# EAGLE schematic RingLight (EAGLE 9.6.2)
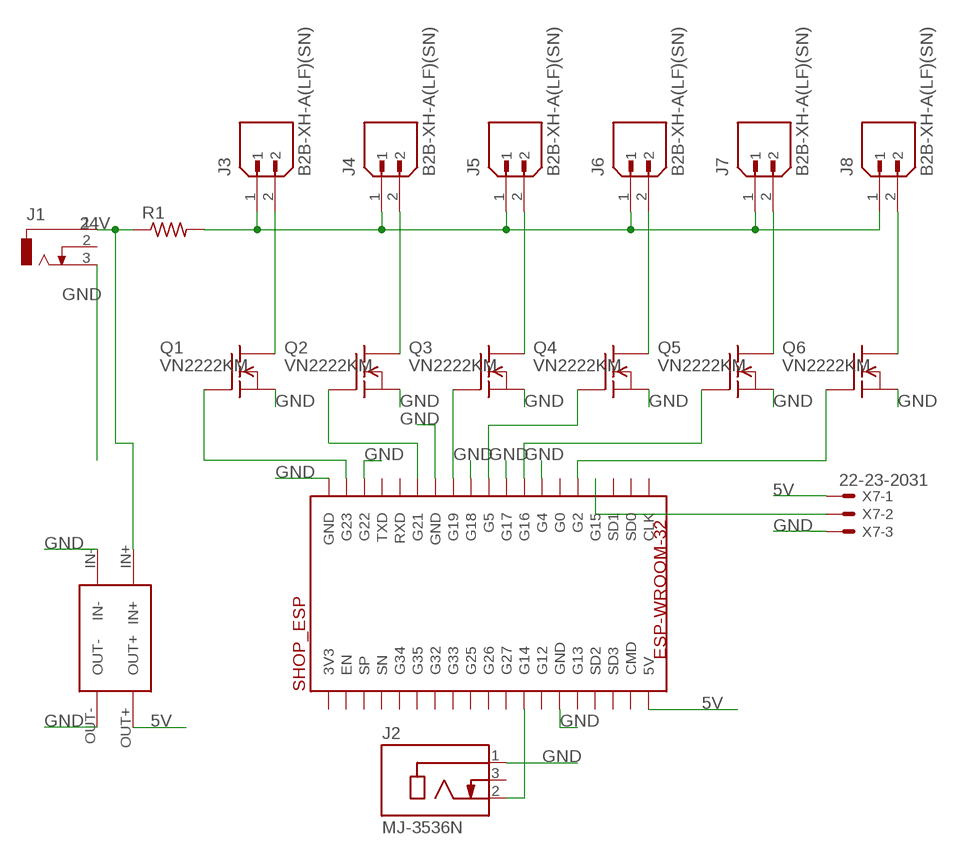
[diagram p0: schematic, sheet 1]

## Parts
J1  DCJ0303  [DCJ0303]
J2  MJ-3536N  [CUI_MJ-3536N]
J3  B2B-XH-A(LF)(SN)  [JST_B2B-XH-A(LF)(SN)]
J4  B2B-XH-A(LF)(SN)  [JST_B2B-XH-A(LF)(SN)]
J5  B2B-XH-A(LF)(SN)  [JST_B2B-XH-A(LF)(SN)]
J6  B2B-XH-A(LF)(SN)  [JST_B2B-XH-A(LF)(SN)]
J7  B2B-XH-A(LF)(SN)  [JST_B2B-XH-A(LF)(SN)]
J8  B2B-XH-A(LF)(SN)  [JST_B2B-XH-A(LF)(SN)]
Q1  VN2222KM  [TO237]
Q2  VN2222KM  [TO237]
Q3  VN2222KM  [TO237]
Q4  VN2222KM  [TO237]
Q5  VN2222KM  [TO237]
Q6  VN2222KM  [TO237]
R1  R-US_0204/7  [0204/7]
U$2  BUCK-CONVERTER  [LM2596DC-DC]
U$4  SHOP_ESP  [ESP32-WROOM-32]
X7  22-23-2031  [22-23-2031]

## Nets
5V: U$2.OUT+ U$4.P$1(5V) X7.1
24V: J1.1 R1.1 U$2.IN+
GND: J1.3 J2.1 Q1.3(S) Q2.3(S) Q3.3(S) Q4.3(S) Q5.3(S) Q6.3(S) U$2.IN- U$2.OUT- U$4.P$6(GND) U$4.P$26(G4) U$4.P$28(G17) U$4.P$30(G18) U$4.P$32(GND) U$4.P$36(G22) U$4.P$38(GND) X7.3
IN: J3.1 J4.1 J5.1 J6.1 J7.1 J8.1 R1.2
N$1: J3.2 Q1.1(D)
N$2: J4.2 Q2.1(D)
N$3: J5.2 Q3.1(D)
N$4: J6.2 Q4.1(D)
N$5: J7.2 Q5.1(D)
N$6: Q1.2(G) U$4.P$37(G23)
N$7: U$4.P$23(G15) X7.2
N$8: Q2.2(G) U$4.P$33(G21)
N$9: Q3.2(G) U$4.P$31(G19)
N$10: Q4.2(G) U$4.P$29(G5)
N$11: Q5.2(G) U$4.P$27(G16)
N$12: Q6.2(G) U$4.P$24(G2)
N$13: J2.2 U$4.P$8(G14)
N$14: J8.2 Q6.1(D)
Unconnected: J1.2 J2.3 U$4.P$3(SD3) U$4.P$4(SD2) U$4.P$5(G13) U$4.P$7(G12) U$4.P$9(G27) U$4.P$10(G26) U$4.P$11(G25) U$4.P$12(G33) U$4.P$13(G32) U$4.P$14(G35) U$4.P$15(G34) U$4.P$16(SN) U$4.P$17(SP) U$4.P$18(EN) U$4.P$20(CLK) U$4.P$21(SD0) U$4.P$22(SD1) U$4.P$25(G0) U$4.P$34(RXD) U$4.P$35(TXD)

## Power pins joined to a net without a drawn wire
3V3: U$4.P$19(3V3)
CMD: U$4.P$2(CMD)

## Library data of the parts
J1 = con-jack:DCJ0303: DC POWER JACK Source: DCJ0303.pdf; OC_FARNELL: unknown; OC_NEWARK: unknown
J2 = MJ-3536N:MJ-3536N: 2 Conductors 3 Contacts 12V 3.5 mm Right Angle Through Hole Audio Jack Connector Check availability <https://pricing.snapeda.com/parts/MJ-3536N/CUI%20Devices/view-part?ref=eda>; AVAILABILITY: In Stock; CHECK_PRICES: https://www.snapeda.com/parts/MJ-3536N/CUI+Devices/view-part/?ref=eda; CUI_PURCHASE_URL: https://www.cuidevices.com/product/interconnect/connectors/audio-connectors/jacks/mj-3536n?utm_source=snapeda.com&utm_medium=referral&utm_campaign=snapedaBOM; DESCRIPTION: 3.5 mm, Mono, Right Angle, Through Hole, 2 Conductors, 1 Internal Switch, Audio Jack Connector; MF: CUI Devices; MP: MJ-3536N; PACKAGE: None; PRICE: None; PURCHASE-URL: https://www.snapeda.com/api/url_track_click_mouser/?unipart_id=559067&manufacturer=CUI Devices&part_name=MJ-3536N&search_term=mj-3536n; SNAPEDA_LINK: https://www.snapeda.com/parts/MJ-3536N/CUI+Devices/view-part/?ref=snap
J3-J8 = B2B-XH-A_LF__SN_:B2B-XH-A(LF)(SN): Check availability <https://pricing.snapeda.com/parts/B2B-XH-A%28LF%29%28SN%29/JST%20Sales/view-part?ref=eda>; AVAILABILITY: In Stock; CHECK_PRICES: https://www.snapeda.com/parts/B2B-XH-A(LF)(SN)/JST+Sales+America+Inc./view-part/?ref=eda; DESCRIPTION: Connector Header Through Hole 2 position 0.098 (2.50mm); MF: JST Sales; MP: B2B-XH-A(LF)(SN); PACKAGE: None; PRICE: None; SNAPEDA_LINK: https://www.snapeda.com/parts/B2B-XH-A(LF)(SN)/JST+Sales+America+Inc./view-part/?ref=snap
Q1-Q6 = transistor-fet:VN2222KM: N-Channel Enhancement MOSFET (VMOS); 60V; 0,5A; 7,5Ohm
R1 = rcl:R-US_: RESISTOR, American symbol; SPICEPREFIX: R
U$2 = buck:BUCK-CONVERTER: I could probably make the symbol better in free time
U$4 = ElcPartsLibrary:SHOP_ESP
X7 = con-molex:22-23-2031: .100" (2.54mm) Center Header - 3 Pin; MF: MOLEX; MPN: 22-23-2031; OC_FARNELL: 1462950; OC_NEWARK: 30C0862